# Altium project mmsVersion1.PrjPcb
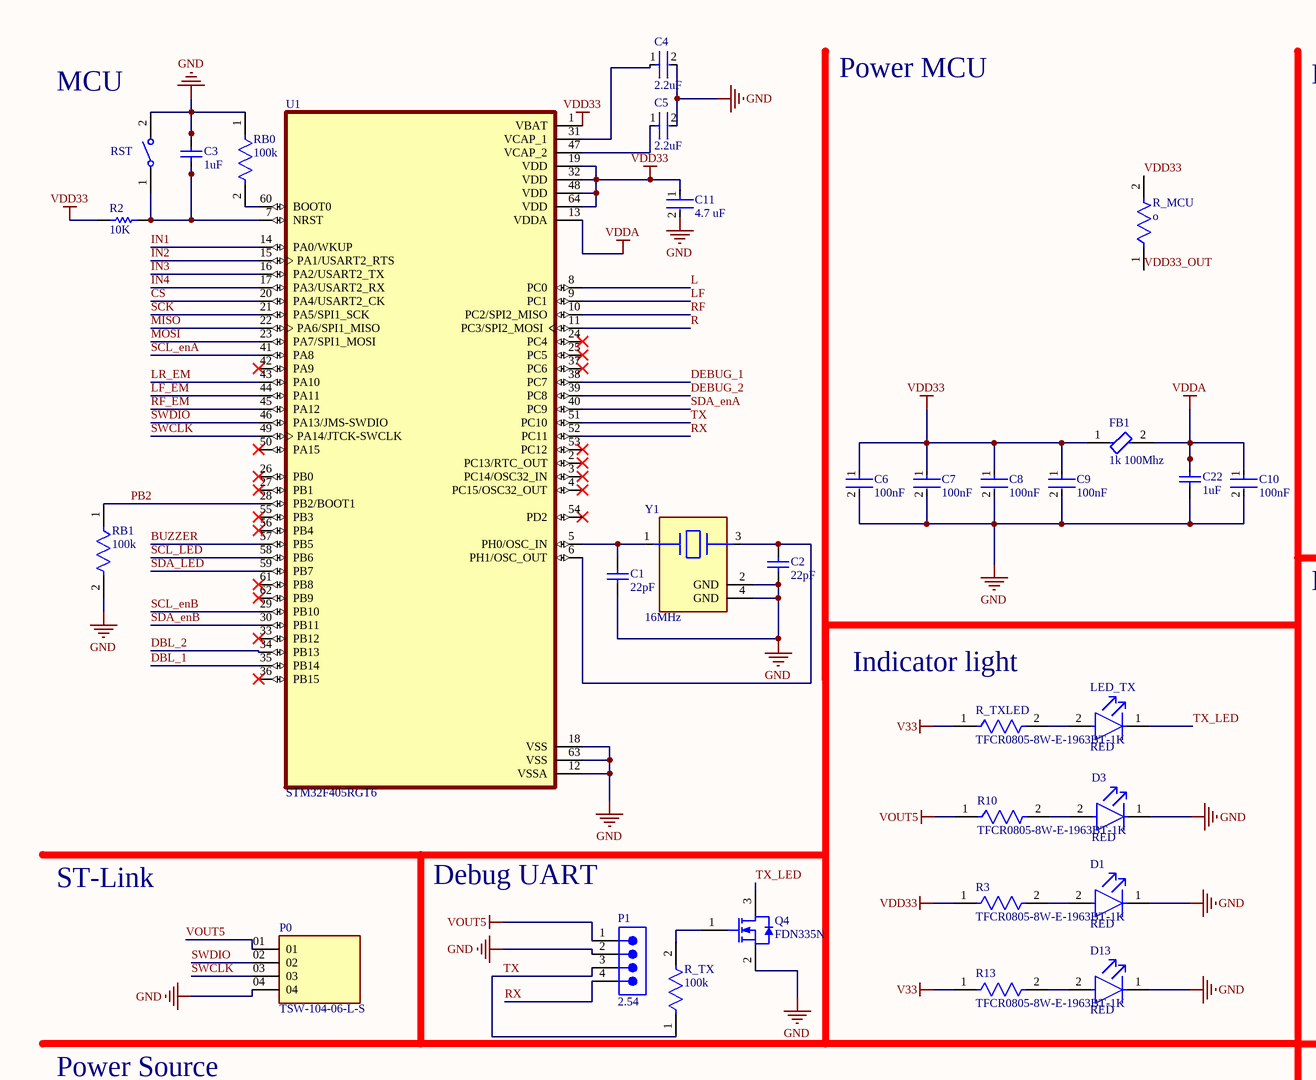
[diagram p0: Micromouse_1_2.SchDoc, top left]
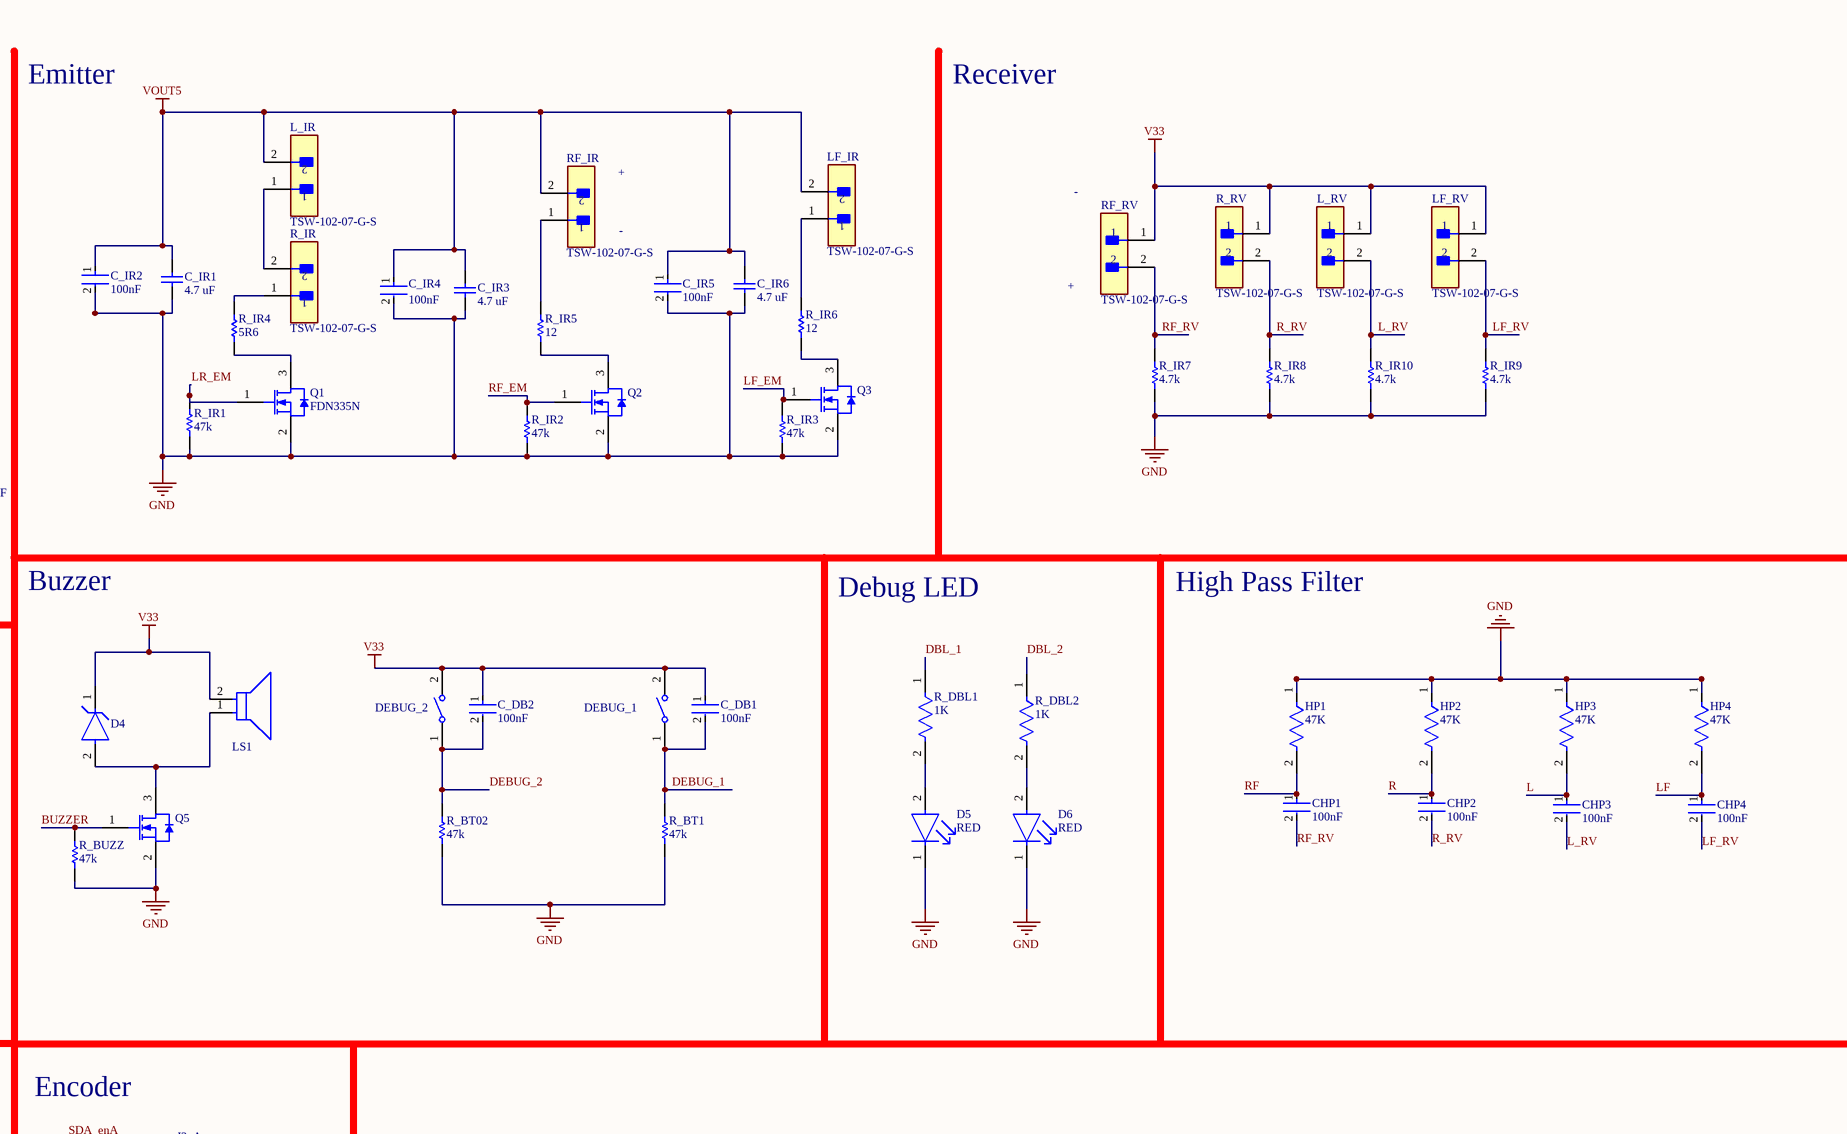
[diagram p1: Micromouse_1_2.SchDoc, top right]
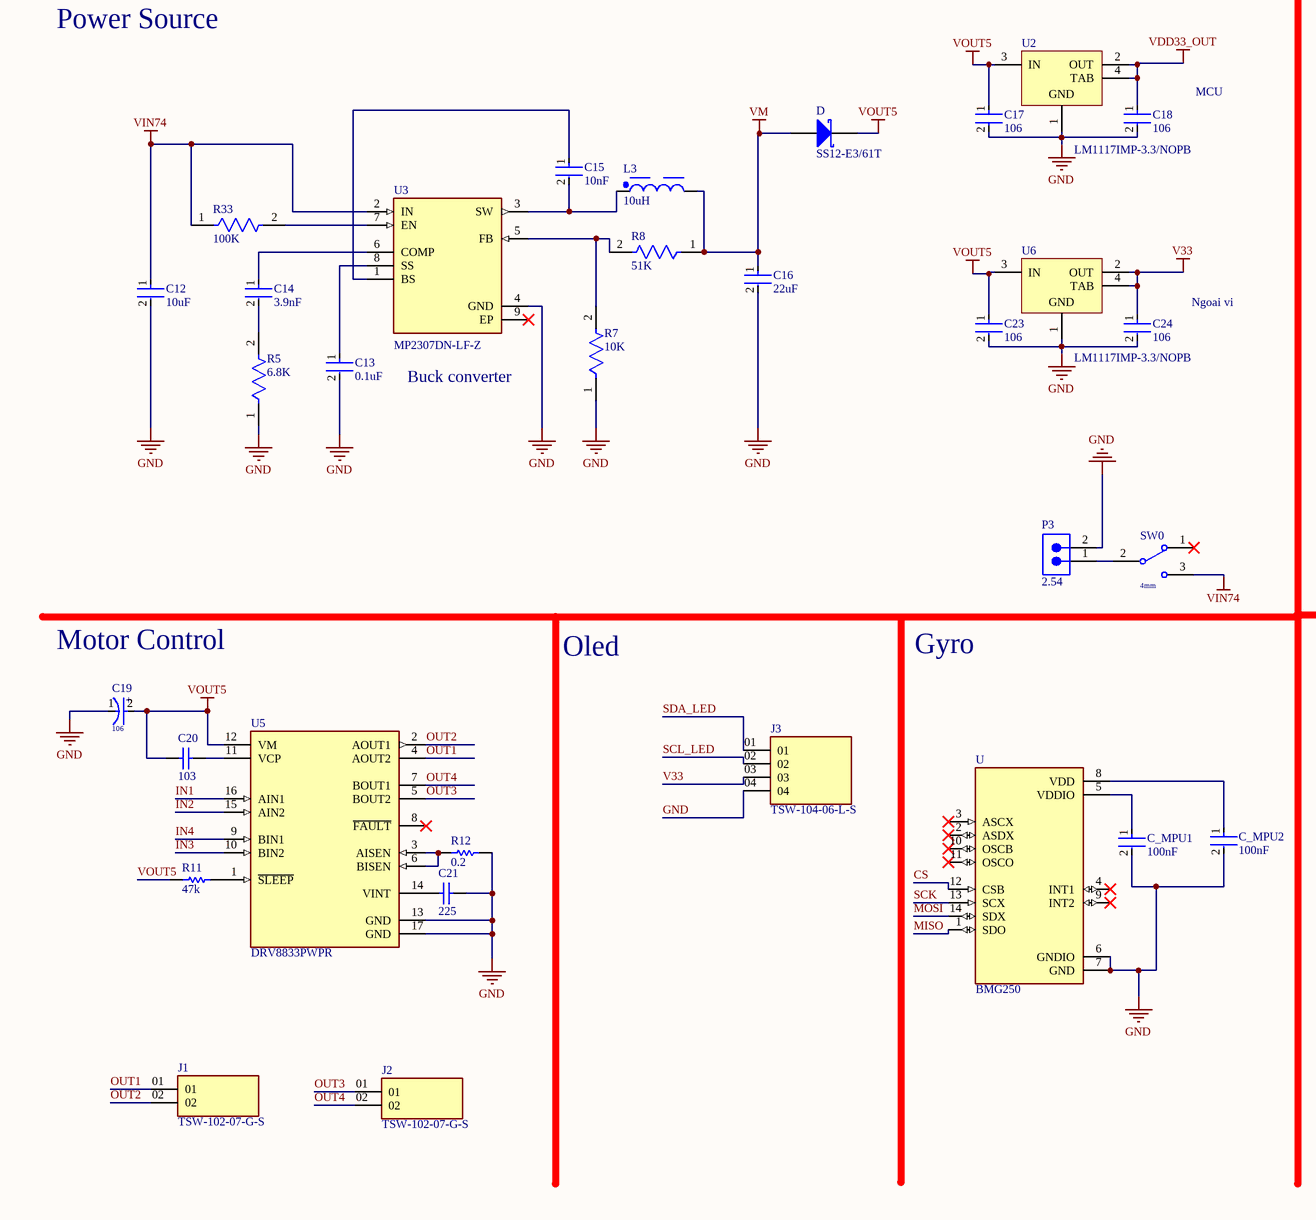
[diagram p2: Micromouse_1_2.SchDoc, bottom left]
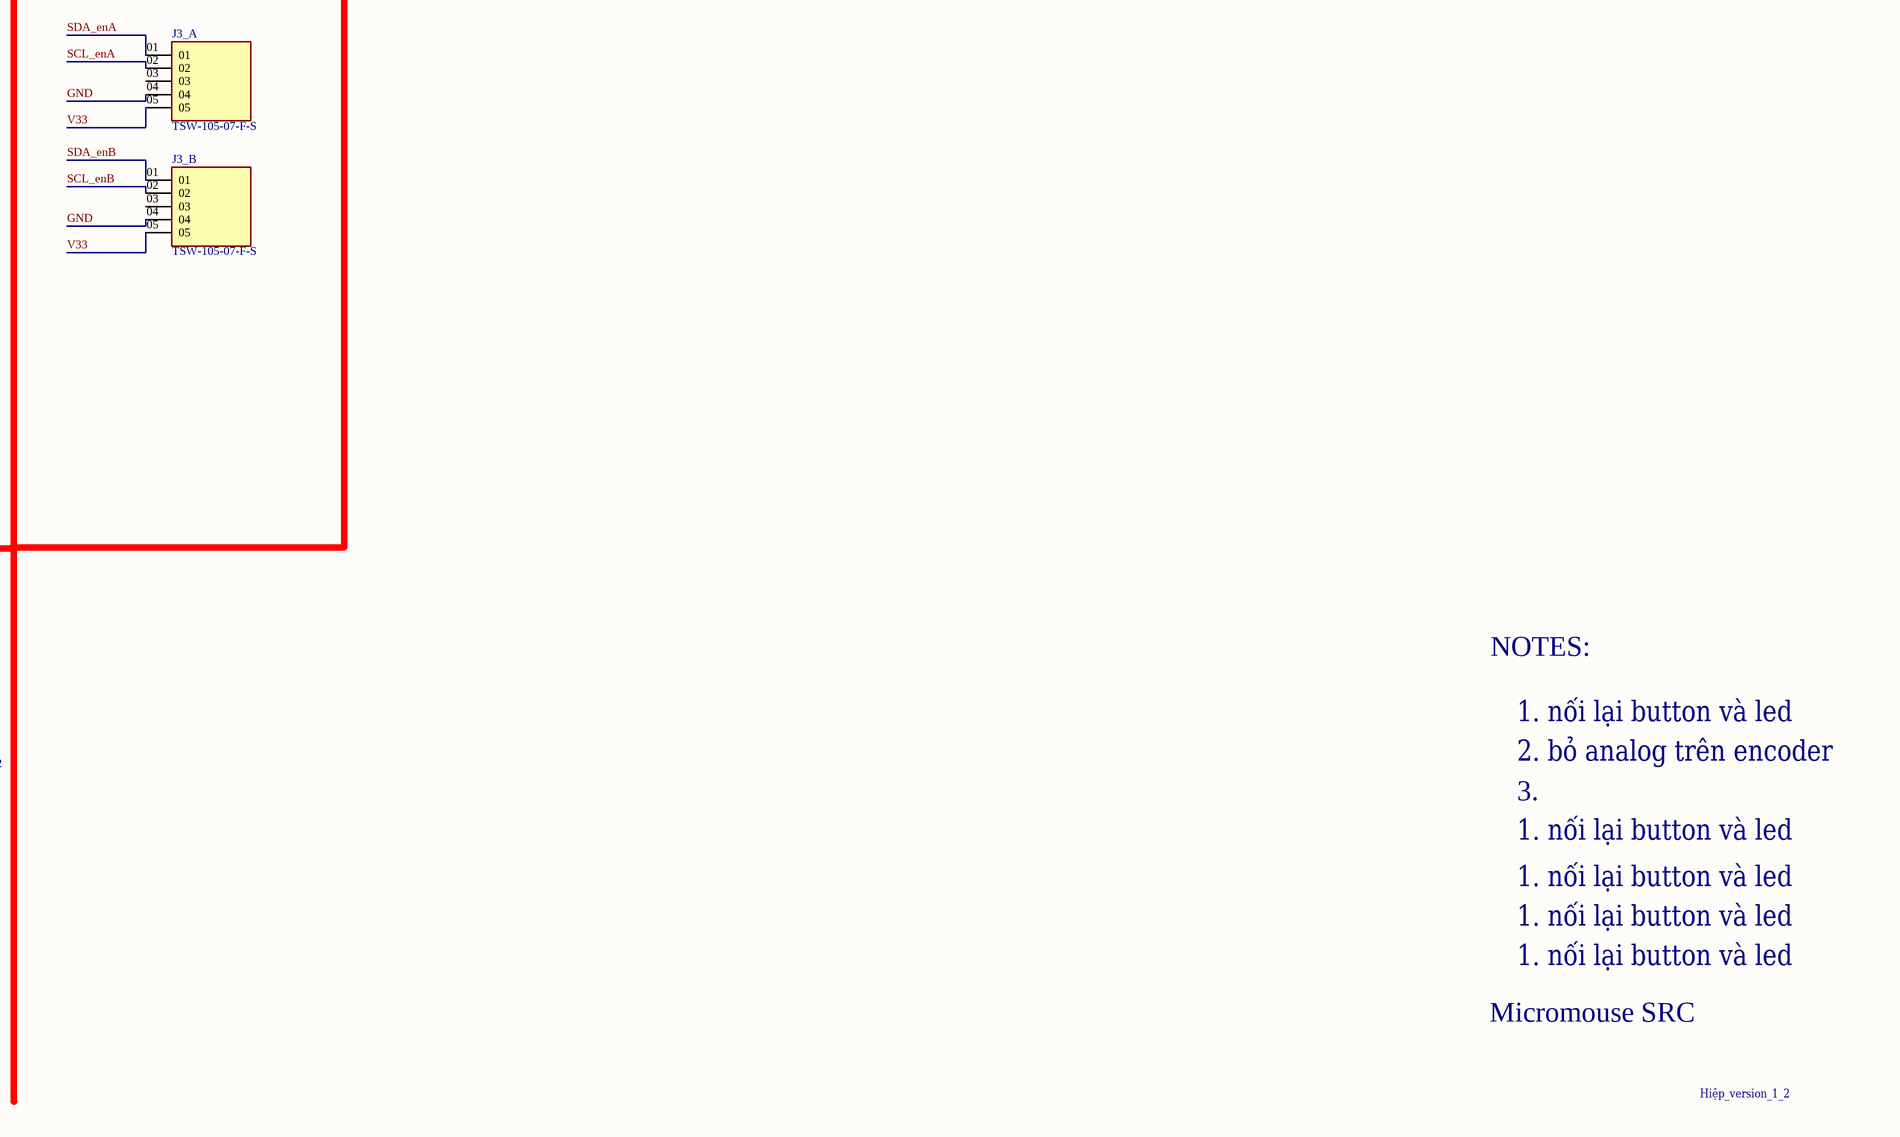
[diagram p3: Micromouse_1_2.SchDoc, bottom right]
1 sheet, 115 parts. Net scope: global (net labels, ports and power ports of the same name join across sheets).
Board file: Micromouse_1_2.PcbDoc

## Sheet Micromouse_1_2.SchDoc
size 594 x 420 mm; SheetNumber: 1; SheetTotal: 1

### Parts
C1  22pF  [CAPC1608X92X38ML15T08]
C2  22pF  [CAPC1608X92X38ML15T08]
C3  1uF  [CAPC1608X90X35NL15T15]
C4  2.2uF  [FP-CL21-IPC_B]
C5  2.2uF  [FP-CL21-IPC_B]
C6  100nF  [FP-CL10-IPC_C]
C7  100nF  [FP-CL10-IPC_C]
C8  100nF  [FP-CL10-IPC_C]
C9  100nF  [FP-CL10-IPC_C]
C10  100nF  [FP-CL10-IPC_C]
C11  4.7 uF  [FP-C0603-CG-MFG]
C12  10uF  [FP-C1206C-EB-MFG]
C13  0.1uF  [FP-C1206C-EB-MFG]
C14  3.9nF  [FP-C1206C-EB-MFG]
C15  10nF  [FP-C1206C-EB-MFG]
C16  22uF  [FP-C1206C-EB-MFG]
C17  106  [FP-GRT31C-0_2-IPC_A]
C18  106  [FP-GRT31C-0_2-IPC_A]
C19  106  [FP-T491C-MFG]
C20  103  [CAPC2013X88X50LL20T25]
C21  225  [CAPC3216X180X50LL20T25]
C22  1uF  [CAPC1608X90X35NL15T15]
C23  106  [FP-GRT31C-0_2-IPC_A]
C24  106  [FP-GRT31C-0_2-IPC_A]
C_DB1  100nF  [FP-CL10-IPC_C]
C_DB2  100nF  [FP-CL10-IPC_C]
C_IR1  4.7 uF  [CAPC2013X145X48ML20T23]
C_IR2  100nF  [FP-CL10-IPC_C]
C_IR3  4.7 uF  [CAPC2013X145X48ML20T23]
C_IR4  100nF  [FP-CL10-IPC_C]
C_IR5  100nF  [FP-CL10-IPC_C]
C_IR6  4.7 uF  [CAPC2013X145X48ML20T23]
C_MPU1  100nF  [FP-CL10-IPC_C]
C_MPU2  100nF  [FP-CL10-IPC_C]
CHP1  100nF  [FP-CL10-IPC_C]
CHP2  100nF  [FP-CL10-IPC_C]
CHP3  100nF  [FP-CL10-IPC_C]
CHP4  100nF  [FP-CL10-IPC_C]
D  SS12-E3/61T  [VISH-DO-214AC_V]
D1  RED  [FP-LTST-C190GKT-MFG]
D3  RED  [FP-LTST-C190GKT-MFG]
D4  MMSZ5232B  [FP-MA02A-MFG]  (value not drawn)
D5  RED  [FP-LTST-C190GKT-MFG]
D6  RED  [FP-LTST-C190GKT-MFG]
D13  RED  [FP-LTST-C190GKT-MFG]
DEBUG_1  (no value)  [TECO-FSMSMTR_V]
DEBUG_2  (no value)  [TECO-FSMSMTR_V]
FB1  1k 100Mhz  [FP-BLM21-0_2-t0_85-e0_5-IPC_C]
HP1  47K  [FP-CRCW0805-e3-IPC_A]
HP2  47K  [FP-CRCW0805-e3-IPC_A]
HP3  47K  [FP-CRCW0805-e3-IPC_A]
HP4  47K  [FP-CRCW0805-e3-IPC_A]
J1  TSW-102-07-G-S  [SAMTEC_TSW-102-07-G-S]
J2  TSW-102-07-G-S  [SAMTEC_TSW-102-07-G-S]
J3  TSW-104-06-L-S  [SAMTEC_TSW-104-06-L-S]
J3_A  TSW-105-07-F-S  [SAMTEC_TSW-105-07-F-S]
J3_B  TSW-105-07-F-S  [SAMTEC_TSW-105-07-F-S]
L3  10uH  [WE-TPC_5818]
L_IR  TSW-102-07-G-S  [FP-TSW-102-07-G-S-MFG]
L_RV  TSW-102-07-G-S  [FP-TSW-102-07-G-S-MFG]
LED_TX  RED  [FP-LTST-C190GKT-MFG]
LF_IR  TSW-102-07-G-S  [FP-TSW-102-07-G-S-MFG]
LF_RV  TSW-102-07-G-S  [FP-TSW-102-07-G-S-MFG]
LS1  MCKPX-G1203A-K4056  [FP-MCKPX-G1203A-K4056-MFG]  (value not drawn)
P0  TSW-104-06-L-S  [SAMTEC_TSW-104-06-L-S]
P1  2.54  [61300411121]
P3  2.54  [61300211121]
Q1  FDN335N  [FAIR-SSOT3L-3_V]
Q2  (no value)  [FAIR-SSOT3L-3_V]
Q3  (no value)  [FAIR-SSOT3L-3_V]
Q4  FDN335N  [FAIR-SSOT3L-3_V]
Q5  (no value)  [FAIR-SSOT3L-3_V]
R2  10K  [RESC1206(3216)_M]
R3  TFCR0805-8W-E-1963BT-1K  [FP-TFCR0805-MFG]
R5  6.8K  [FP-CRCW0805-e3-IPC_B]
R7  10K  [FP-CRCW0805-e3-IPC_B]
R8  51K  [FP-CRCW0805-e3-IPC_B]
R10  TFCR0805-8W-E-1963BT-1K  [FP-TFCR0805-MFG]
R11  47k  [RESC3216X60X45LL10T20]
R12  0.2  [RESC3216X89X51ML25T25]
R13  TFCR0805-8W-E-1963BT-1K  [FP-TFCR0805-MFG]
R33  100K  [FP-CRCW0805-e3-IPC_B]
R_BT1  47k  [RESC2013X60X35NL10T20]
R_BT02  47k  [RESC2013X60X35NL10T20]
R_BUZZ  47k  [RESC2013X60X35NL10T20]
R_DBL1  1K  [FP-CRCW0805-e3-IPC_A]
R_DBL2  1K  [FP-CRCW0805-e3-IPC_A]
R_IR  TSW-102-07-G-S  [FP-TSW-102-07-G-S-MFG]
R_IR1  47k  [RESC2013X60X35NL10T20]
R_IR2  47k  [RESC2013X60X35NL10T20]
R_IR3  47k  [RESC2013X60X35NL10T20]
R_IR4  5R6  [RESC2013X50X30NL20T20]
R_IR5  12  [RESC2013X50X30NL20T20]
R_IR6  12  [RESC2013X50X30NL20T20]
R_IR7  4.7k  [YAGO-RC0805_M]
R_IR8  4.7k  [YAGO-RC0805_M]
R_IR9  4.7k  [YAGO-RC0805_M]
R_IR10  4.7k  [YAGO-RC0805_M]
R_MCU  o  [FP-TFCR0805-MFG]
R_RV  TSW-102-07-G-S  [FP-TSW-102-07-G-S-MFG]
R_TX  100k  [FP-TFCR0805-MFG]
R_TXLED  TFCR0805-8W-E-1963BT-1K  [FP-TFCR0805-MFG]
RB0  100k  [FP-RC3216-IPC_C]
RB1  100k  [FP-RC3216-IPC_C]
RF_IR  TSW-102-07-G-S  [FP-TSW-102-07-G-S-MFG]
RF_RV  TSW-102-07-G-S  [FP-TSW-102-07-G-S-MFG]
RST  (no value)  [TECO-FSMSMTR_V]
SW0  4mm  [ESWI-EG1218_V]
U  BMG250  [XDCR_BMG250]
U1  STM32F405RGT6  [QFP50P1200X1200X160-64N]
U2  LM1117IMP-3.3/NOPB  [DCY0004A_N]
U3  MP2307DN-LF-Z  [SOIC127P600X170-9N]
U5  DRV8833PWPR  [FP-PWP0016C-IPC_B]
U6  LM1117IMP-3.3/NOPB  [DCY0004A_N]
Y1  16MHz  [FP-ABM10W-MFG]

### Nets
GND: C1.1 C2.1 C3.2 C4.2 C5.2 C6.2 C7.2 C8.2 C9.2 C10.2 C11.2 C12.2 C13.2 C16.2 C17.2 C18.2 C19.1(C) C21.2 C22.1 C23.2 C24.2 C_IR1.1 C_IR2.2 C_IR3.1 C_IR4.2 C_IR5.2 C_IR6.1 C_MPU1.2 C_MPU2.2 D1.1(C) D3.1(C) D5.1(C) D6.1(C) D13.1(C) HP1.1 HP2.1 HP3.1 HP4.1 J3.04 J3_A.04 J3_B.04 P0.04 P1.2 P3.2 Q1.2(S) Q2.2(S) Q3.2(S) Q4.2(S) Q5.2(S) R5.1 R7.1 R12.2 R_BT1.1 R_BT02.1 R_BUZZ.1 R_IR1.1 R_IR2.1 R_IR3.1 R_IR7.1 R_IR8.1 R_IR9.1 R_IR10.1 RB0.1 RB1.2 RST.2 U.6(GNDIO) U.7(GND) U1.12(VSSA) U1.18(VSS) U1.63(VSS) U2.1(GND) U3.4(GND) U5.13(GND) U5.17(GND) U6.1(GND) Y1.2(GND) Y1.4(GND)
V33: C24.1 C_DB1.1 C_DB2.1 D4.1(C) DEBUG_1.2 DEBUG_2.2 J3.03 J3_A.05 J3_B.05 L_RV.1 LF_RV.1 LS1.2(A) R13.1 R_RV.1 R_TXLED.1 RF_RV.1 U6.2(OUT) U6.4(TAB)
VDD33: C6.1 C7.1 C8.1 C9.1 C11.1 FB1.1 R2.1 R3.1 R_MCU.2 U1.1(VBAT) U1.19(VDD) U1.32(VDD) U1.48(VDD) U1.64(VDD)
VDD33_OUT: C18.1 R_MCU.1 U2.2(OUT) U2.4(TAB)
VDDA: C10.1 C22.2 FB1.2 U1.13(VDDA)
VIN74: C12.1 R33.1 SW0.3 U3.2(IN)
VM: C16.1 D.1(A) L3.2 R8.1
VOUT5: C17.1 C19.2(A) C20.1 C23.1 C_IR1.2 C_IR2.1 C_IR3.2 C_IR4.1 C_IR5.1 C_IR6.2 D.2(K) L_IR.2 LF_IR.2 P0.01 P1.1 R10.1 R11.1 RF_IR.2 U2.3(IN) U5.12(VM) U6.3(IN)
BUZZER: Q5.1(G) R_BUZZ.2 U1.57(PB5)
CS: U.12(CSB) U1.20(PA4/USART2_CK)
DBL_1: R_DBL1.1 U1.35(PB14)
DBL_2: R_DBL2.1 U1.34(PB13)
DEBUG_1: C_DB1.2 DEBUG_1.1 R_BT1.2 U1.38(PC7)
DEBUG_2: C_DB2.2 DEBUG_2.1 R_BT02.2 U1.39(PC8)
IN1: U1.14(PA0/WKUP) U5.16(AIN1)
IN2: U1.15(PA1/USART2_RTS) U5.15(AIN2)
IN3: U1.16(PA2/USART2_TX) U5.10(BIN2)
IN4: U1.17(PA3/USART2_RX) U5.9(BIN1)
L: CHP3.1 HP3.2 U1.8(PC0)
L_RV: CHP3.2 L_RV.2 R_IR10.2
LF: CHP4.1 HP4.2 U1.9(PC1)
LF_EM: Q3.1(G) R_IR3.2 U1.44(PA11)
LF_RV: CHP4.2 LF_RV.2 R_IR9.2
LR_EM: Q1.1(G) R_IR1.2 U1.43(PA10)
MISO: U.1(SDO) U1.22(PA6/SPI1_MISO)
MOSI: U.14(SDX) U1.23(PA7/SPI1_MOSI)
OUT1: J1.01 U5.4(AOUT2)
OUT2: J1.02 U5.2(AOUT1)
OUT3: J2.01 U5.5(BOUT2)
OUT4: J2.02 U5.7(BOUT1)
PB2: RB1.1 U1.28(PB2/BOOT1)
R: CHP2.1 HP2.2 U1.11(PC3/SPI2_MOSI)
R_RV: CHP2.2 R_IR8.2 R_RV.2
RF: CHP1.1 HP1.2 U1.10(PC2/SPI2_MISO)
RF_EM: Q2.1(G) R_IR2.2 U1.45(PA12)
RF_RV: CHP1.2 R_IR7.2 RF_RV.2
RX: P1.4 U1.52(PC11)
SCK: U.13(SCX) U1.21(PA5/SPI1_SCK)
SCL_enA: J3_A.02 U1.41(PA8)
SCL_enB: J3_B.02 U1.29(PB10)
SCL_LED: J3.02 U1.58(PB6)
SDA_enA: J3_A.01 U1.40(PC9)
SDA_enB: J3_B.01 U1.30(PB11)
SDA_LED: J3.01 U1.59(PB7)
SWCLK: P0.03 U1.49(PA14/JTCK-SWCLK)
SWDIO: P0.02 U1.46(PA13/JMS-SWDIO)
TX: P1.3 R_TX.1 U1.51(PC10)
TX_LED: LED_TX.1(C) Q4.3(D)
NetC1_2: C1.2 U1.5(PH0/OSC_IN) Y1.1
NetC2_2: C2.2 U1.6(PH1/OSC_OUT) Y1.3
NetC3_1: C3.1 R2.2 RST.1 U1.7(NRST)
NetC4_1: C4.1 U1.31(VCAP_1)
NetC5_1: C5.1 U1.47(VCAP_2)
NetC13_1: C13.1 U3.8(SS)
NetC14_1: C14.1 U3.6(COMP)
NetC14_2: C14.2 R5.2
NetC15_1: C15.1 U3.1(BS)
NetC15_2: C15.2 L3.1 U3.3(SW)
NetC20_2: C20.2 U5.11(VCP)
NetC21_1: C21.1 U5.14(VINT)
NetC_MPU1_1: C_MPU1.1 U.5(VDDIO)
NetC_MPU2_1: C_MPU2.1 U.8(VDD)
NetD1_2: D1.2(A) R3.2
NetD3_2: D3.2(A) R10.2
NetD4_2: D4.2(A) LS1.1(C) Q5.3(D)
NetD5_2: D5.2(A) R_DBL1.2
NetD6_2: D6.2(A) R_DBL2.2
NetD13_2: D13.2(A) R13.2
NetL_IR_1: L_IR.1 R_IR.2
NetLED_TX_2: LED_TX.2(A) R_TXLED.2
NetLF_IR_1: LF_IR.1 R_IR6.2
NetP3_1: P3.1 SW0.2(COM)
NetQ1_3: Q1.3(D) R_IR4.1
NetQ2_3: Q2.3(D) R_IR5.1
NetQ3_3: Q3.3(D) R_IR6.1
NetQ4_1: Q4.1(G) R_TX.2
NetR7_2: R7.2 R8.2 U3.5(FB)
NetR11_2: R11.2 U5.1(~{SLEEP})
NetR12_1: R12.1 U5.3(AISEN) U5.6(BISEN)
NetR33_2: R33.2 U3.7(EN)
NetR_IR5_2: R_IR5.2 RF_IR.1
NetR_IR_1: R_IR.1 R_IR4.2
NetRB0_2: RB0.2 U1.60(BOOT0)

Not connected (* = marked no-connect by the designer): J3_A 03; J3_B 03; SW0 1*; U 2(ASDX)* 3(ASCX)* 4(INT1)* 9(INT2)* 10(OSCB)* 11(OSCO)*; U1 2(PC13/RTC_OUT)* 3(PC14/OSC32_IN)* 4(PC15/OSC32_OUT)* 24(PC4)* 25(PC5)* 26(PB0)* 27(PB1)* 33(PB12)* 36(PB15)* 37(PC6)* 42(PA9)* 50(PA15)* 53(PC12)* 54(PD2)* 55(PB3)* 56(PB4)* 61(PB8)* 62(PB9)*; U3 9(EP)*; U5 8(~{FAULT})*

### Notes on the sheet
- MCU
- Power MCU
- Emitter
- Receiver
- (near RF_IR) +
- -
- +
- Buzzer
- High Pass Filter
- Debug LED
- Indicator light
- ST-Link
- Debug UART
- Power Source
- Encoder
- Ngoai vi
- Buck converter
- Motor Control
- Oled
- Gyro
- NOTES:
- 1. nối lại button và led
- 2. bỏ analog trên encoder
- 3.
- Micromouse SRC
- Hiệp_version_1_2
- (in symbol CMP-03017-000001-1) +

### Library data of the parts
C1 C2 = CMP-1035-00826-2: Part Number: VJ0603A220FXBAC; Manufacturer: Vitramon
C3 C22 = CMP-2006-04534-1: Part Number: 0603YD105MAT2A; Manufacturer: AVX Interconnect / Elco
C4 C5 = CMP-13271-004097-1: CL21 Series 0805 2.2uF 16V -20/+80% Tolerance Y5V Multilayer Ceramic Chip Capacitor; Tolerance: 80%; Voltage: 10V; Packaging: Tape and Reel; Package Quantity: 10000; Length: 2mm; Depth: 1.25mm; Dielectric: Y5V; Width: 0.049inch; Voltage Rating (DC): 16V; Lead Free: Lead Free; Height: 1.25mm; Mount: Surface Mount; Min Operating Temperature: -30°C; Radiation Hardening: No; Case/Package: 0805; Thickness: 0.053inch; Voltage Rating: 16V; Max Operating Temperature: 85°C; Capacitance: 2.2uF
C6-C10 C_DB1 C_DB2 C_IR2 C_IR4 C_IR5 C_MPU1 C_MPU2 CHP1-CHP4 = CMP-13271-001423-1: Cap Ceramic 100nF 25V X7R ±10% Pad SMD 0603 +125°C T/R; Depth: 0.8mm; Tolerance: 10%; Case Code (Imperial): 0603; Max Operating Temperature: 125°C; Min Operating Temperature: -55°C; Dielectric: X7R; Width: 0.031inch; Thickness: 0.035inch; Height: 0.8mm; Length: 1.6mm; Mount: Surface Mount; Capacitance: 100nF; Voltage Rating: 25V; Case Code (Metric): 1608; Case/Package: 0603; Radiation Hardening: No; Packaging: Tape and Reel
C11 = CMP-2006-02256-2: CAP CER 4.7UF 6.3V X5R 0603; Manufacturer: Kemet; Manufacturer Part Number: C0603C475K9PACTU; Temperature Coefficient: 15%; Tolerance: 10%; Material: Ceramic; Device Class L3: Ceramic Capacitors; RoHS: TRUE; Value: 4.7uF; Lead Free: Yes; ComponentLink2Description: Datasheet; Mouser Description: Multilayer Ceramic Capacitors MLCC - SMD/SMT 6.3volts 4.7uF X5R 10%; Package: C0603-CG; Digikey Description: CAP CER 4.7UF 6.3V X5R 0603; ComponentLink2URL: https://content.kemet.com/datasheets/KEM_C1006_X5R_SMD.pdf; Category: Cap; Temperature Range Low: -55°C; Capacitance: 4.7uF; Temperature: -55°C to +85°C; Octopart: https://octopart.com/c0603c475k9pactu-kemet-104242; Ipc Land Pattern Name: CAPC16080X80; Voltage Rating: 6.3V; Temperature Range High: +85°C; Height: 0.9mm; Temperature Characteristic: X5R; Device Class L1: Passive Components; Automotive: No; Device Class L2: Capacitors
C12 = CMP-1037-00646-2: C1206 10 uF C0G 5.00% 50 V; Manufacturer Part Number: C1206C100J5GAC; Manufacturer: KEMET; Material: Ceramic; Automotive Grade: Grade 0; Voltage Rating: 50 V; Value: 10 pF; Temperature Coefficient: 15%; Tolerance: 0.05; Temperature: -55°C to +150°C; ComponentLink2URL: https://content.kemet.com/datasheets/KEM_C1007_X8R_ULTRA_150C_SMD.pdf; RoHS: TRUE; Lead Free: Yes; Category: Cap; Package: C1206C-EB; Device Class L2: Capacitors; Device Class L1: Passive Components; ComponentLink2Description: Datasheet; Ipc Land Pattern Name: CAPC320160X78; Device Class L3: Ceramic Capacitors; Temperature Characteristic: C0G; Octopart: https://octopart.com/c1206c100j5gac-kemet-1357555; Automotive: Yes; Height: 0.88mm; Temperature Range High: +150°C; Mouser Description: Multilayer Ceramic Capacitors MLCC - SMD/SMT 50volts 10pF 5% C0G; Temperature Range Low: -55°C; Capacitance: 10 pF
C13 C15 C16 = CMP-1037-00646-2: C1206 10 pF C0G 5.00% 50 V; Manufacturer Part Number: C1206C100J5GAC; Manufacturer: KEMET; Material: Ceramic; Automotive Grade: Grade 0; Voltage Rating: 50 V; Value: 10 pF; Temperature Coefficient: 15%; Tolerance: 0.05; Temperature: -55°C to +150°C; ComponentLink2URL: https://content.kemet.com/datasheets/KEM_C1007_X8R_ULTRA_150C_SMD.pdf; RoHS: TRUE; Lead Free: Yes; Category: Cap; Package: C1206C-EB; Device Class L2: Capacitors; Device Class L1: Passive Components; ComponentLink2Description: Datasheet; Ipc Land Pattern Name: CAPC320160X78; Device Class L3: Ceramic Capacitors; Temperature Characteristic: C0G; Octopart: https://octopart.com/c1206c100j5gac-kemet-1357555; Automotive: Yes; Height: 0.88mm; Temperature Range High: +150°C; Mouser Description: Multilayer Ceramic Capacitors MLCC - SMD/SMT 50volts 10pF 5% C0G; Temperature Range Low: -55°C; Capacitance: 10 pF
C14 = CMP-1037-00646-2: C1206 4.8nF C0G 5.00% 50 V; Manufacturer Part Number: C1206C100J5GAC; Manufacturer: KEMET; Material: Ceramic; Automotive Grade: Grade 0; Voltage Rating: 50 V; Value: 10 pF; Temperature Coefficient: 15%; Tolerance: 0.05; Temperature: -55°C to +150°C; ComponentLink2URL: https://content.kemet.com/datasheets/KEM_C1007_X8R_ULTRA_150C_SMD.pdf; RoHS: TRUE; Lead Free: Yes; Category: Cap; Package: C1206C-EB; Device Class L2: Capacitors; Device Class L1: Passive Components; ComponentLink2Description: Datasheet; Ipc Land Pattern Name: CAPC320160X78; Device Class L3: Ceramic Capacitors; Temperature Characteristic: C0G; Octopart: https://octopart.com/c1206c100j5gac-kemet-1357555; Automotive: Yes; Height: 0.88mm; Temperature Range High: +150°C; Mouser Description: Multilayer Ceramic Capacitors MLCC - SMD/SMT 50volts 10pF 5% C0G; Temperature Range Low: -55°C; Capacitance: 10 pF
C17 C18 C23 C24 = CMP-06035-000076-2: Multi-Layer Ceramic Capacitor 10uF 50V X5R ±10% 1206 Emboss T/R; Length: 0.126inch; Max Operating Temperature: 85°C; Width: 0.063inch; Ratings: AEC-Q200; Voltage Rating: 50V; Dielectric: X5R; Min Operating Temperature: -55°C; Case Code (Imperial): 1206; Capacitance: 10uF; Case Code (Metric): 3216; Thickness: 0.071inch; Tolerance: 10%; Mount: Surface Mount; Case/Package: 1206; Packaging: Cut Tape; Voltage Rating (DC): 50V
C19 = CMP-03017-000001-1: CAP TANT 10UF 10% 25V 2312; Manufacturer Part Number: T491C106K025AT; Manufacturer: Kemet; Material: Tantalum; Standoff Height: 0mm; Life: 2000Hours; Dissipation Factor: 6%; Esr: 1.5Ω; Ripple Current: 271mA; Leakage Current: 2.5uA; Digikey Description: CAP TANT 10UF 10% 25V 2312; Voltage Rating: 25V; Device Class L3: Tantalum Capacitors; ComponentLink2Description: Datasheet; Tolerance: 10%; Device Class L2: Capacitors; Temperature: -55°C to +125°C; Octopart: https://octopart.com/t491c106k025at-kemet-126002; Automotive: No; Height: 2.8mm; Package: T491C; Temperature Range Low: -55°C; Lead Free: Yes; Capacitance: 10uF; Category: Cap; Mouser Description: Tantalum Capacitors - Solid SMD 25V 10uF 10% C; Temperature Range High: +125°C; Value: 10uF; Device Class L1: Passive Components; ComponentLink2URL: https://content.kemet.com/datasheets/KEM_T2005_T491.pdf; RoHS: TRUE
C20 = CMP-2007-00266-1: Manufacturer: Kemet; Part Number: C0805C103K5RACTU
C21 = CMP-1037-04831-2: Chip Capacitor, 2.2 uF, +/- 10%, 50 V, -55 to 125 degC, 1206 (3216 Metric), RoHS, Tape and Reel; Manufacturer: Kemet; Case Width: 1.6mm; Capacitance - nF: 2200nF; Capacitance: 2.2uF; Class: Class1; Type: SMDMLCCX7R6.3-250VDCCommericalGrade; Voltage Rating: 50V; Case Length: 3.2mm; Dielectric: X7R; Temperature Coefficient / Code: +/-15%; Product Category: MultilayerCeramicCapacitorsMLCC-SMD/SMT; Package Description: 2-Pin Surface Mount Device, Body 3.2 x 1.6 mm; Minimum Operating Temperature: -55C; RoHS: Details; Package / Case: 1206(3216metric); Packaging: Reel; Case Code - mm: 3216; Datasheet Version: 02/2016; Tolerance: 10%; Series: C1206C; Dimensions: 1.6mmWx3.2mmLx1.6mmH; Case Height: 1.6mm; Brand: Kemet; Mounting Technology: SurfaceMount; Manufacturer URL: http://www.kemet.com/; Voltage Rating DC: 50V; Datasheet URL: http://www.kemet.com/docfinder?Partnumber=C1206C225K5RACTU; Maximum Operating Temperature: +125C; Case Code - in: 1206; Package Reference: 1206; Termination Style: SMD/SMT; Operating Temperature Range: -55Cto+125C; Product: GeneralTypeMLCCs; Factory Pack Quantity: 2000
C_IR1 C_IR3 C_IR6 = CMP-2007-03205-1: Manufacturer: Vitramon; Part Number: VJ0805Y682KXAMT
D = CMP-004-00017-2: Schottky Barrier Rectifier, 20 V, 1 A, -65 to 150 degC, 2-Pin DO-214AC (SMA), RoHS, Tape and Reel; Manufacturer: Vishay Semiconductor; Forward Voltage: 500mV; Peak Reverse Current: 6mA; Max Surge Current: 40A; Forward Current: 1A; Package Quantity: 1800; Datasheet URL: http://www.vishay.com/docs/88746/ss12.pdf; Manufacturer URL: http://www.vishay.com/; Package Reference: DO-214AC (SMA); Max Operating Temperature: 125°C; Mounting Technology: SM; Case/Package: SMA; Min Operating Temperature: -65°C; Package Description: 2-Pin Surface Mount Device, Body 4.245 x 2.665 mm; RoHS Compliant: True; Datasheet Version: Aug-15; Pins: 2; Packaging: TapeandReel
D1 D3 D5 D6 D13 LED_TX = CMP-22017-000005-2: LED GREEN CLEAR CHIP SMD; Dominant Wavelength: 569nm; Reverse Voltage: 5V; Lens Color: Colorless; Viewing Angle: 130°; Voltage: 2V; Forward Current: 30mA; Power Dissipation: 100mW; Luminous Intensity: 6mcd; Number of LEDs: 1; Forward Voltage: 2.1V; Wavelength: 565nm; Test Current: 10mA; Min Operating Temperature: -55°C; Lens Style: Clear; Mount: Surface Mount; Width: 0.8mm; Packaging: Tape and Reel; Lens Transparency: Clear; Case Code (Metric): 1608; Depth: 0.8mm; Case Code (Imperial): 0603; Case/Package: 0603; Number of Pins: 2; Max Operating Temperature: 85°C; Lead Free: Lead Free; Number of Elements: 1; Length: 1.6mm; Height: 0.8mm; Package Quantity: 1; Power Rating: 100mW; Radiation Hardening: No; Illumination Color: Green; Color: Green
D4 = CMP-00278-11829623-1: MMSZ5232B MMSZ523 Series 500 mW 5.6 V 10 mA SMT Half-Watt Zener Diode SOD-123; ESD Protection: No; Peak Reverse Current: 5µA; Max Junction Temperature (Tj): 150°C; Forward Voltage: 900mV; Power Rating: 500mW; Reverse Voltage: 3V; Tolerance: 5%; Zener Voltage: 5.6V; Element Configuration: Single; Impedance: 11Ω; Test Current: 20mA; Height: 1.28mm; NexarPartId: 11829623; Radiation Hardening: No; Weight: 30mg; Min Operating Temperature: -55°C; Voltage Tolerance: 5%; Max Operating Temperature: 150°C; Voltage Rating (DC): 5.6V; Lead Free: Lead Free; RoHS: Compliant; Width: 1.8mm; Contact Plating: Tin; Zener Current: 20mA; Working Voltage: 5.6V; Packaging: Cut Tape; Length: 2.85mm; Max Power Dissipation: 500mW; Power Dissipation: 500mW; Max Reverse Leakage Current: 5µA; Number of Pins: 2; Mount: Surface Mount; REACH SVHC: No SVHC
DEBUG_1 DEBUG_2 RST = CMP-2000-07501-1: FSMSM Push Button Switch, 50 mA, -35 to 85 degC, 2-Pin SMD, RoHS, Tape and Reel; Manufacturer: TE Connectivity; Voltage Rating (DC): 24V; Electrical Life: 20000Cycles; Operating Force: 180gf; Switch Travel: 0.25mm; Contact Current Rating: 50mA; Case\/Package: SMD/SMT; Actuator Length: 1.07mm; Throw Configuration: SPST; Actuator Material: Polyamide; Contact Resistance: 100mOhm; Illumination Type: Illuminated; Max Voltage Rating (DC): 12V; Manufacturer URL: http://www.te.com/; Lead Free: LeadFree; Packaging: TapeandReel; Min Operating Temperature: -35degC; Mechanical Life: 20000Cycles; Mount: SurfaceMount; REACH SVHC: Unknown; Package Quantity: 1800; Package Reference: FSMSMTR; RoHSCompliant: true; Max Operating Temperature: 85degC; Orientation: Straight; ELV: Compliant; Datasheet URL: http://www.te.com/commerce/DocumentDelivery/DDEController?Action=showdoc&DocId=Customer+Drawing%7F1437566-3%7FC2%7Fpdf%7FEnglish%7FENG_CD_1437566-3_C2_1437566_3_1_c.dwg.pdf%7F1437566-4; Package Description: 2-Pin Surface Mount Device, Body 6 x 3.5 mm, Pitch 9.19 mm; Current Rating: 50mA; Contact Plating: Silver; Termination: GullWing; Datasheet Version: Rev. C2, 08/2014; Contact Material: Brass; Mounting Technology: SurfaceMount
FB1 = CMP-06046-002606-1: Chip Ferrite Bead, 0805, 60Ω @ 100MHz, 0.02Ω, 25%, 1.9A; RoHS Compliant: No
HP1-HP4 R_DBL1 R_DBL2 = CMP-02407-005778-1: RES Thick Film, 1kΩ, 5%, 0.125W, 200ppm/°C, 0805; Max Power Dissipation: 125mW; Resistance: 1kR; Composition: Thick Film; Height: 0.02inch; Length: 0.079inch; Features: Automotive AEC-Q200; Tolerance: 5%; Lead Free: Lead Free; Contact Plating: Tin; Max Operating Temperature: 155°C; Width: 0.049inch; Case/Package: 0805; Min Operating Temperature: -55°C; Number of Terminations: 2; Package Quantity: 20000; Packaging: Tape and Reel; Temperature Coefficient: 200ppm/°C; Radiation Hardening: No
J1 J2 = TSW-102-07-G-S: MF: Samtec; Package: None; Price: None; Value: *; MP: TSW-102-07-G-S; Availability: Unavailable
J3 P0 = CMP-009-000000-1: Pin Count: 4; MP: TSW-104-06-L-S; Source: TSW-104-06-L-S.SchLib; Design Item ID: TSW-104-06-L-S; Price: None; Value: *; Availability: Unavailable; Component Type: Standard; Package: None
J3_A J3_B = CMP-023-000001-1: MF: Samtec; Component Type: Standard; MP: TSW-105-07-F-S; Availability: Unavailable; Package: None; Pin Count: 5; Value: *; Design Item ID: TSW-105-07-F-S; Price: None; Source: TSW-105-07-F-S.SchLib
L3 = CMP-0227-00416-3: NexarPartId: 22866864; DC Resistance (DCR): 70mΩ; Current Rating: 1.45A; Test Frequency: 100kHz; Shielding: Shielded; Tolerance: 30%; Saturation Current: 1.6A; Core Material: Ferrite; Inductance: 6.2µH; Self Resonant Frequency: 45MHz; Case Code (Imperial): 2323; Weight: 248.001628mg; Ambient Temperature Range Low: -40°C; Height - Seated (Max): 2.0066mm; Ambient Temperature Range High: 95°C; Height: 1.8mm; Number of Pins: 2; Inductance Tolerance: 30%; Max DC Current: 1.45A; Min Operating Temperature: -40°C; Depth: 5.8mm; Composition: Wirewound; Case/Package: 2323; Case Code (Metric): 5858; Packaging: Cut Tape (CT); Termination: SMD/SMT; Length: 5.8mm; Mount: Surface Mount; REACH SVHC: Unknown; Max Operating Temperature: 125°C; RoHS: Compliant; RMS Current (Irms): 1.45A; Width: 5.8mm
L_IR L_RV LF_IR LF_RV R_IR R_RV RF_IR RF_RV = CMP-02766-000084-1: CONN HEADER VERT 2POS 2.54MM; Manufacturer: Samtec; Number Of Contacts: 2; Voltage Rating: 550V; Conn Orientation: Straight; Current Rating: 6.3A; Conn Gender: Male; Package: TSW-102-07-G-S; Digikey Description: CONN HEADER VERT 2POS 2.54MM; ComponentLink2URL: http://suddendocs.samtec.com/catalog_english/tsw_th.pdf; Height: 8.71mm; Temperature: -55°C to +125°C; Device Class L2: Headers and Wire Housings; ComponentLink2Description: Datasheet; Device Class L3: unset; Contact Material: Gold,Nickel; Temperature Range Low: -55°C; Temperature Range High: +125°C; RoHS: TRUE; Device Class L1: Connectors; Mouser Description: Conn Unshrouded Header HDR 2 POS 2.54mm Solder ST Thru-Hole Automotive Bulk; Number Of Rows: 1; Category: Conn; Pitch: 2.54mm; Lead Free: Yes; Automotive: No; Manufacturer Part Number: TSW-102-07-G-S; Footprint Url: http://suddendocs.samtec.com/prints/tsw-xxx-xx-x-x-xx-xxx-footprint.pdf; Octopart: https://octopart.com/tsw-102-07-g-s-samtec-272197
LS1 = CMP-12433-000001-1: MAGNETIC BUZZER AND TRANSDUCER - More Details; Manufacturer: Multicomp Pro; Operating Supply Voltage: 3V; Current: 30mA; Frequency: 2300Hz; Max Supply Voltage: 5V; Min Supply Voltage: 2V; Standoff Height: 0.5mm; ComponentLink2Description: Datasheet; ComponentLink2URL: http://www.farnell.com/datasheets/1498149.pdf?_ga=2.17855225.1157923166.1572356775-536200964.1569240579; Manufacturer Part Number: MCKPX-G1203A-K4056; Temperature Range High: +70°C; Device Class L2: Audio Products; Temperature Range Low: -20°C; Package: 0; Temperature: -20°C to +70°C; Category: Speak; Octopart: https://octopart.com/mckpx-g1203a-k4056-multicomp-12157154; RoHS: TRUE; Lead Free: Yes; Height: 9.5mm; Device Class L1: Electromechanical; Automotive: No; Device Class L3: Buzzers
P1 = CMP-1502-01064-3: NexarPartId: 32855522; Operating Supply Voltage: 250V; Pitch: 2.54mm; Contact Resistance: 20mΩ; Number of Positions: 4; Current Rating: 3A; Connector Type: Male Pin; Gender: Male; Contact Plating: Gold; Height: 8.89mm; Lead Pitch: 2.54mm; Lead Free: Lead Free; Contact Mating Length: 5.9944mm; Number of Rows: 1; Termination: Solder; Packaging: Bulk; REACH SVHC: Unknown; Min Operating Temperature: -40°C; RoHS: Compliant; Number of Contacts: 4; Voltage Rating: 250V; Color: Black; Max Operating Temperature: 105°C; Contact Material: Copper; Mount: Through Hole; Orientation: Vertical; Number of Pins: 4
P3 = CMP-1712-00002-6: NexarPartId: 20081794; Number of Contacts: 2; Pitch: 2.54mm; Connector Type: Male Pin; Voltage Rating: 250V; Current Rating: 3A; Gender: Male; Contact Resistance: 20mΩ; Height: 8.94mm; Lead Free: Lead Free; Number of Pins: 2; Termination: Through Hole; RoHS: Compliant; Lead Pitch: 2.54mm; REACH SVHC: No SVHC; Housing Material: PBT; Contact Mating Length: 5.9944mm; Min Operating Temperature: -40°C; Orientation: Vertical; Contact Material: Copper; Contact Gender: Male; Max Operating Temperature: 125°C; Number of Rows: 1; Number of Positions: 2; Packaging: Bulk; Contact Plating: Gold; Mount: Through Hole; Color: Black; Operating Supply Voltage: 250V
Q1-Q5 = CMP-2000-06249-1: N-Channel Specified PowerTrench(R) MOSFET, 2.5 V, 1.7 A, -55 to 150 degC, 3-Pin SSOT3L, RoHS, Tape and Reel; Manufacturer: FairchildSemiconductor; RDS-on: 0.07@4.5VOhm; Typical Fall Time: 3ns; Maximum Drain Source Voltage: 20V; Rad Hard: No; Channel Mode: Enhancement; Package Version: Rev. 3, 05/2015; Maximum Gate Source Voltage: ±8V; Typical Rise Time: 8.5ns; Typical Turn-Off Delay Time: 11ns; Maximum Continuous Drain Current: 1.7A; Channel Type: N; Typical Turn-On Delay Time: 5ns; Packaging: Tape&Reel; Mounting Technology: SurfaceMount; Mounting: SurfaceMount; Manufacturer URL: https://www.fairchildsemi.com/; Datasheet URL: https://www.fairchildsemi.com/datasheets/FD/FDN335N.pdf; Package Description: 3-Pin Small Outline Transistor, Body 2.92 x 1.4 mm, Pitch 0.95 mm; Package URL: https://www.fairchildsemi.com/package-drawings/MA/MA03B.pdf; Datasheet Version: Rev. C, 04/1999; Package Reference: SSOT3L; Package: 3SuperSOT; Operating Temperature: -55to150°C; Category: MOSFET
R2 = CMP-1014-00098-1: 10K 0.25W 5% 1206 (3216 Metric)  SMD; Value: 10000.00 Ohm; Case-Metric: 3216; Case-EIA: 1206; Power: 0.25 W; Tolerance: 5 %; Technology: SMT
R3 R10 R13 R_MCU R_TX R_TXLED = CMP-250906-256246-1: RES Thin Film,  196kΩ, 0.1%, 0.125W, 25ppm/°C, 0805
R5 R7 R8 R33 = CMP-02407-004732-1: RES Thick Film, 2.49Ω, 1%, 0.125W, 200ppm/°C, 0805; Voltage Rating: 150V; Resistance: 2.49R; Max Power Dissipation: 125mW; Max Operating Temperature: 155°C; Tolerance: 1%; Termination: SMD/SMT; Packaging: Tape and Reel; Height: 0.02inch; Case Code (Imperial): 0805; Radiation Hardening: No; Width: 1.25mm; Voltage Rating (DC): 150V; Number of Terminations: 2; Lead Free: Lead Free; Features: Automotive AEC-Q200; Power Rating: 125mW; Case/Package: 0805; Length: 0.079inch; Contact Plating: Tin; Composition: Thick Film; Weight: 0.000194oz; Package Quantity: 5000; Min Operating Temperature: -55°C; Case Code (Metric): 2012; Temperature Coefficient: 200ppm/°C
R11 = CMP-2003-02213-1: Part Number: CRCW120647K0FKEA; Manufacturer: Vishay Dale
R12 = CMP-2003-04372-1: Manufacturer: Vishay Dale; Part Number: WSL1206R2000FEA
R_BT1 R_BT02 R_BUZZ R_IR1-R_IR3 = CMP-1659-00011-4: Chip Resistor, 47 KOhm, +/- 1%, 0.125 W, -55 to 155 degC, 0805 (2012 Metric), RoHS, Tape and Reel; Manufacturer: Yageo; Voltage Rating: 150 V; Height: 0.5 mm; ComponentLink2URL: http://www.yageo.com/documents/recent/PYu-RC_Group_51_RoHS_L_04.pdf; ComponentLink2Description: Datasheet; Package Quantity: 200; Max Operating Temperature: 155 degC; Min Operating Temperature: -55 degC; Packaging: Tape and Reel; Pins: 2; PackageReference: 0805; Mounting Technology: Surface Mount; ComponentLink1Description: Manufacturer URL; ComponentLink1URL: http://www.yageo.com/; PackageDescription: 2-Pin Surface Mounted Device, Body 2 x 1.25 mm; Length: 2 mm; REACH SVHC: No SVHC; Mount: Surface Mount; RoHSCompliant: true; DatasheetVersion: Rev. 4, 02/2016
R_IR4-R_IR6 = CMP-2001-04915-1: Manufacturer: Vishay Dale; Part Number: CRCW080510R0FKEA
R_IR7-R_IR10 = CMP-1568-00001-1: General Puprose Chip Resistor, 4700 Ohm +/- 1%, 0.125 W, -55 to 155 degC, 2-Pin SMD, RoHS, Tape and Reel; PartNumber: RC0805FR-074K7L; Tolerance: +/- 1%; Power: 0.125 W; PackageDescription: 2-Pin Surface Mount Device, Body 2 x 1.25 mm; ComponentLink2URL: http://www.yageo.com/documents/recent/PYu-RC_Group_51_RoHS_L-3.pdf; Temperature Min: -55 degC; Packing: Tape and Reel; Mounting Technology: Surface Mount; ComponentLink1URL: http://www.yageo.com/NewPortal/_en/index.jsp; Resistance: 4700 Ohm; Temperature Max: 155 degC; ComponentLink2Description: Datasheet; DatasheetVersion: Rev. 3; RoHS: TRUE; ComponentLink1Description: Manufacturer URL
RB0 RB1 = CMP-13261-005388-1: Res Thick Film 1206 10kΩ 5% 0.25W ±100ppm/°C Molded SMD T/R; Resistance: 10kR; Voltage Rating (DC): 200V; Max Power Dissipation: 250mW; Case Code (Metric): 3216; Radiation Hardening: No; Contact Plating: Tin; Packaging: Tape and Reel; Case Code (Imperial): 1206; Composition: Thick Film; Height: 0.026inch; Features: Moisture Resistant; Temperature Coefficient: 100ppm/°C; Tolerance: 5%; Length: 0.126inch; Min Operating Temperature: -55°C; Depth: 1.6mm; Case/Package: 1206; Number of Terminations: 2; Width: 0.063inch; Lead Free: Lead Free; Military Standard: Not; Max Operating Temperature: 155°C
SW0 = CMP-1696-00002-1: Slide Switch, 500 V, -20 to 70 degC, 3-Pin THD, RoHS; Case\Package: SOT-23-5; Output Current: 150 mA; Nominal Output Voltage: 3.3 V; Max Power Dissipation: 250 mW; Min Input Voltage: 4.3 V; Outputs: 1; Max Input Voltage: 8 V; Dropout Voltage: 300 mV; PackageDescription: 3-Pin Through Hole Device, Body 11.6 x 4 mm, Pitch 2.5 mm; ComponentLink1URL: http://www.e-switch.ch/en/; RoHSCompliant: true; Length: 3 mm; ComponentLink1Description: Manufacturer URL; Power Rating: 250 mW; Mount: Surface Mount; Max Operating Temperature: 85 degC; REACH SVHC: No SVHC; Radiation Hardening: No; Height: 1.3 mm; Pins: 5; Max Ouput Current: 150 mA; Output Voltage: 3.3 V; Width: 1.8 mm; Package Quantity: 3000; ComponentLink2URL: https://www.e-switch.com/system/asset/product_line/data_sheet/119/EG.pdf; Min Operating Temperature: -40 degC; ComponentLink2Description: Datasheet; DatasheetVersion: Oct-15; PackageReference: EG1218; Packaging: Tape and Reel
U = BMG250: Gyroscope X _Pitch_, Y _Roll_, Z _Yaw_ Â±125, 250, 500, 1000, 2000 25Hz ~ 3200Hz IÂ²C, SPI; MF: Bosch; MP: BMG250; SnapEDA_Link: https://www.snapeda.com/parts/BMG250/Bosch%20Sensortec/view-part/627823/?ref=snap; Value: *; Package: LGA-14 Bosch Tools; Price: None; Availability: Unavailable
U1 = CMP-031-00006-1: ARMÂ® CortexÂ®-M4 STM32F4 Microcontroller IC 32-Bit Single-Core 168MHz 1MB (1M x 8) FLASH 64-LQFP (10x10); MF: STMicroelectronics; Check_prices: https://www.snapeda.com/parts/STM32F405RGT6/STMicroelectronics/view-part/?ref=eda; Design Item ID: STM32F405RGT6; MP: STM32F405RGT6; Source: STM32F405RGT6.SchLib; Component Type: Standard; Value: *; SnapEDA_Link: https://www.snapeda.com/parts/STM32F405RGT6/STMicroelectronics/view-part/?ref=snap; Pins: 64; Case/Package: LQFP-64 STMicroelectronics
U2 U6 = CMP-0062-01631-4: 800mA Low-Dropout Linear Regulator, 4-pin SOT-223, Pb-Free; Manufacturer: Texas Instruments; PackageTopMarking: XYTT*N05B; PowerWise: N; High-Reliability: Y; CompType: LDO IC; Code_IPC: SOT223-4; PackageReference: DCY0004A; PinCount: 4; PackageDescription: Molded SOT-223, 6.50 x 3.56 x 1.6mm Body, 4 Lead, 2.3mm Pitch; PartNumber: LM1117IMP-3.3/NOPB; RoHS: Y; ComponentLink1Description: Datasheet URL; Code_JEDEC: TO-261-AA; ComponentLink1URL: http://www.ti.com/general/docs/lit/getliterature.tsp?genericPartNumber=LM1117-N&fileType=pdf
U3 = MP2307DN-LF-Z: Buck Switching Regulator IC Positive Adjustable 0.925V 1 Output 3A 8-SOIC (0.154, 3.90mm Width) Exposed Pad; MF: Monolithic Power; Check_prices: https://www.snapeda.com/parts/MP2307DN-LF-Z/Monolithic+Power+Systems+Inc./view-part/?ref=eda; SnapEDA_Link: https://www.snapeda.com/parts/MP2307DN-LF-Z/Monolithic+Power+Systems+Inc./view-part/?ref=snap; Availability: In Stock; Value: *; Price: None; MP: MP2307DN-LF-Z; Package: SOIC-8 Monolithic Power; Purchase-URL: https://pricing.snapeda.com/search/part/MP2307DN-LF-Z/?ref=eda
U5 = CMP-1529-00004-3: IC MOTOR DRIVER PAR 16HTSSOP; Supply Current: 3mA; Max Output Current: 2A; Interface: PWM; Output Current: 1.5A; Max Supply Voltage: 10.8V; Fault Protection: Over Temperature; Number of Outputs: 2; Min Supply Voltage: 2.7V; Nominal Supply Current: 3mA; Series: DRV8833; Min Operating Temperature: -40°C; Package Quantity: 2000; Packaging: Tape and Reel; Case/Package: HTSSOP; Output Current per Channel: 1.5A; RoHS Compliant: Yes; RMS Current (Irms): 1.5A; Max Operating Temperature: 85°C; Technology: NMOS; Number of Pins: 16; Radiation Hardening: No; Lead Free: Lead Free; REACH SVHC: No SVHC
Y1 = CMP-27762-010110-1: CRYSTAL 16.0000MHZ 4PF SMD; ESR (Equivalent Series Resistance): 100R; Frequency Tolerance: 10ppm; Mount: Surface Mount; Case/Package: SMD/SMT; Max Operating Temperature: 70°C; Frequency: 16MHz; Packaging: Tape and Reel; Min Operating Temperature: -20°C; RoHS Compliant: Yes; Frequency Stability: 10ppm; Load Capacitance: 4pF